# Altium schematic sheet PCB_Project_Wavelength.SchDoc
size A3; SheetNumber: 1; SheetTotal: 1
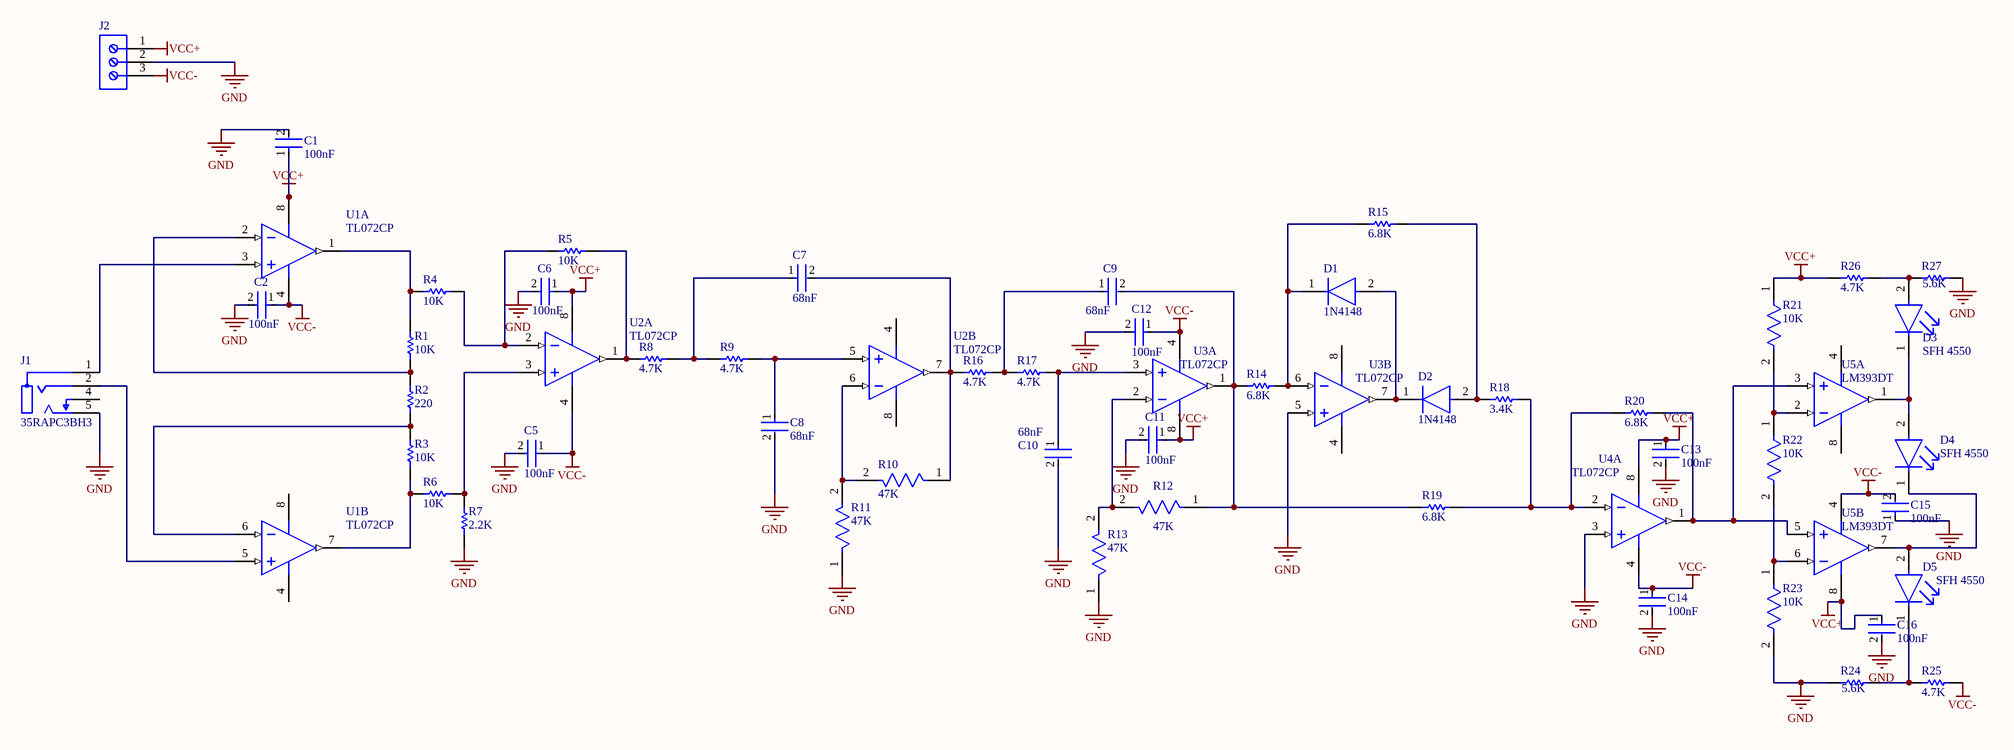
[diagram p0: PCB_Project_Wavelength.SchDoc]

## Parts
C1  100nF  [FP-CGA3E-0_3-0_1-IPC_A]
C2  100nF  [FP-CGA3E-0_3-0_1-IPC_A]
C5  100nF  [FP-CGA3E-0_3-0_1-IPC_A]
C6  100nF  [FP-CGA3E-0_3-0_1-IPC_A]
C7  68nF  [FP-1206-L_3_2_0_2-W_1_6_0-IPC_A]
C8  68nF  [FP-1206-L_3_2_0_2-W_1_6_0-IPC_A]
C9  68nF  [FP-1206-L_3_2_0_2-W_1_6_0-IPC_A]
C10  68nF  [FP-1206-L_3_2_0_2-W_1_6_0-IPC_A]
C11  100nF  [FP-CGA3E-0_3-0_1-IPC_A]
C12  100nF  [FP-CGA3E-0_3-0_1-IPC_A]
C13  100nF  [FP-CGA3E-0_3-0_1-IPC_A]
C14  100nF  [FP-CGA3E-0_3-0_1-IPC_A]
C15  100nF  [FP-CGA3E-0_3-0_1-IPC_A]
C16  100nF  [FP-CGA3E-0_3-0_1-IPC_A]
D1  1N4148  [FP-017AG-MFG]
D2  1N4148  [FP-017AG-MFG]
D3  SFH 4550  [FP-SFH_4550-MFG]
D4  SFH 4550  [FP-SFH_4550-MFG]
D5  SFH 4550  [FP-SFH_4550-MFG]
J1  35RAPC3BH3  [FP-35RAPC3BH3-MFG]
J2  691709710303  [691709710303]  (value not drawn)
R1  10K  [RESC1609X50X30NL8T20]
R2  220  [RESC2013X70X40NL20T20]
R3  10K  [RESC1609X50X30NL8T20]
R4  10K  [RESC1609X50X30NL8T20]
R5  10K  [RESC1609X50X30NL8T20]
R6  10K  [RESC1609X50X30NL8T20]
R7  2.2K  [RESC1608X55X25LL10T15]
R8  4.7K  [RESC1005X40X25LL05T05]
R9  4.7K  [RESC1005X40X25LL05T05]
R10  47K  [FP-CRCW0603-e3-IPC_B]
R11  47K  [FP-CRCW0603-e3-IPC_B]
R12  47K  [FP-CRCW0603-e3-IPC_B]
R13  47K  [FP-CRCW0603-e3-IPC_B]
R14  6.8K  [RESC1609X50X30LL10T20]
R15  6.8K  [RESC1609X50X30LL10T20]
R16  4.7K  [RESC1005X40X25LL05T05]
R17  4.7K  [RESC1005X40X25LL05T05]
R18  3.4K  [RESC1609X50X30LL10T20]
R19  6.8K  [RESC1609X50X30LL10T20]
R20  6.8K  [RESC1609X50X30LL10T20]
R21  10K  [FP-MCT0603-IPC_C]
R22  10K  [FP-MCT0603-IPC_C]
R23  10K  [FP-MCT0603-IPC_C]
R24  5.6K  [RESC1005X40X25LL05T05]
R25  4.7K  [RESC2013X70X40NL20T20]
R26  4.7K  [RESC2013X70X40NL20T20]
R27  5.6K  [RESC1005X40X25LL05T05]
U1  TL072CP  [P0008A]  (parts A,B of 2)
U2  TL072CP  [P0008A]  (parts A,B of 2)
U3  TL072CP  [P0008A]  (parts A,B of 2)
U4  TL072CP  [P0008A]  (part A of 2)
U5  LM393DT  [STM-SO-8_D_L]  (parts A,B of 2)

## Nets
GND: C1.2 C2.2 C5.2 C6.2 C8.2 C10.2 C11.2 C12.2 C13.2 C14.2 C15.1 C16.2 J1.5 J2.2 R7.1 R11.1 R13.1 R23.2 R24.1 R27.2 U3.5(IN2+) U4.3(IN1+)
VCC+: C1.1 C6.1 C11.1 C13.1 C16.1 J2.1 R21.1 R26.1 U1.8(VCC+) U2.8(VCC+) U3.8(VCC+) U4.8(VCC+) U5.8(VCC+)
VCC-: C2.1 C5.1 C12.1 C14.1 C15.2 J2.3 R25.2 U1.4(VCC-) U2.4(VCC-) U3.4(VCC-) U4.4(VCC-) U5.4(VCC-)
NetC7_1: C7.1 R8.2 R9.1
NetC7_2: C7.2 R10.1 R16.1 U2.7(OUT2)
NetC8_1: C8.1 R9.2 U2.5(IN2+)
NetC9_1: C9.1 R16.2 R17.1
NetC9_2: C9.2 R12.1 R14.1 R19.1 U3.1(OUT1)
NetC10_1: C10.1 R17.2 U3.3(IN1+)
NetD1_1: D1.1(C) R14.2 R15.1 U3.6(IN2-)
NetD1_2: D1.2(A) D2.1(C) U3.7(OUT2)
NetD2_2: D2.2(A) R15.2 R18.1
NetD3_1: D3.1(C) D4.2(A) U5.1(OUT1)
NetD3_2: D3.2(A) R26.2 R27.1
NetD4_1: D4.1(C) D5.2(A) U5.7(OUT2)
NetD5_1: D5.1(C) R24.2 R25.1
NetJ1_1: J1.1 U1.3(IN1+)
NetJ1_2: J1.2 U1.5(IN2+)
NetR1_1: R1.1 R2.2 U1.2(IN1-)
NetR1_2: R1.2 R4.2 U1.1(OUT1)
NetR2_1: R2.1 R3.2 U1.6(IN2-)
NetR3_1: R3.1 R6.2 U1.7(OUT2)
NetR4_1: R4.1 R5.2 U2.2(IN1-)
NetR5_1: R5.1 R8.1 U2.1(OUT1)
NetR6_1: R6.1 R7.2 U2.3(IN1+)
NetR10_2: R10.2 R11.2 U2.6(IN2-)
NetR12_2: R12.2 R13.2 U3.2(IN1-)
NetR18_2: R18.2 R19.2 R20.1 U4.2(IN1-)
NetR20_2: R20.2 U4.1(OUT1) U5.3(IN1+) U5.5(IN2+)
NetR21_2: R21.2 R22.1 U5.2(IN1-)
NetR22_2: R22.2 R23.1 U5.6(IN2-)

Not connected (* = marked no-connect by the designer): J1 4

## Library data of the parts
C1 C2 C5 C6 C11-C16 = CMP-2000-07546-2: Cap Ceramic 100nF 50V X7R 10% Pad SMD 0603 +125°C Automotive T/R; Weight: 7.1E-05oz; Composition: Ceramic; Max Operating Temperature: 125°C; Termination: SMD/SMT; Dielectric: X7R; Length: 1.6mm; Package Quantity: 1; REACH SVHC: No SVHC; Lead Free: Lead Free; Case Code (Metric): 1608; Min Operating Temperature: -55°C; Packaging: Tape and Reel; Tolerance: 10%; Voltage Rating: 50V; Case Code (Imperial): 0603; Capacitance: 100nF; Case/Package: 0603; Voltage Rating (DC): 50V; Depth: 0.8mm; Radiation Hardening: No; Ratings: AEC-Q200; Mount: Surface Mount; Voltage: 50V; Thickness: 0.035inch; Width: 0.8mm; Height: 0.8mm
C7-C10 = CMP-04427-019044-1: General Purpose Ceramic Capacitor, 1206, 68nF, 10%, X7R, 15%, 100V; Dissipation Factor: 2.5%; Construction: Flat; Packaging: Tape and Reel; Min Operating Temperature: -55°C; Package Quantity: 1; Voltage Rating (DC): 100V; Mount: Surface Mount; RoHS Compliant: Yes; Case/Package: 1206; Thickness: 0.037inch; Case Code (Imperial): 1206; Case Code (Metric): 3216; Max Operating Temperature: 125°C; Depth: 1.6mm; Length: 3.2mm; Series: -; REACH SVHC: No SVHC; Voltage: 100V; Number of Pins: 2; Width: 0.063inch; Voltage Rating: 100V; Capacitance: 68nF; Height: 0.94mm; Radiation Hardening: No; Lead Free: Lead Free; Termination: SMD/SMT; Tolerance: 10%; Dielectric: X7R
D1 D2 = CMP-07163-000046-1: DIODE GEN PURP 100V 200MA DO35; Forward Voltage: 1V; Max Power Dissipation: 500mW; Max Reverse Current: 5uA; Forward Current: 300mA; Current: 4A; Reverse Recovery Time: 4ns; Element Configuration: Single; Outside Diameter: 1.85mm; Capacitance: 4pF; Polarity: Standard; Max Forward Surge Current (Ifsm): 1A; Reverse Voltage: 100V; Output Current: 200mA; Average Rectified Current: 200mA; Diameter: 1.91mm; Max Repetitive Reverse Voltage (Vrrm): 100V; Current Rating: 200mA; Case/Package: DO-35; Lead Free: Lead Free; Number of Pins: 2; Recovery Time: 4ns; Packaging: Bulk; Contact Plating: Tin; Voltage: 100V; Mount: Through Hole; Max Surge Current: 4A; Package Quantity: 2000; Width: 1.91mm; Max Reverse Voltage (DC): 100V; Length: 4.56mm; Radiation Hardening: No; Power Dissipation: 500mW; Voltage Rating (DC): 100V; Peak Non-Repetitive Surge Current: 4A; REACH SVHC: No SVHC; Height: 4.56mm; Max Operating Temperature: 175°C; Series: -; Weight: 0.01lb; Min Operating Temperature: -65°C
D3-D5 = CMP-62016-000011-1: EMITTER IR 860NM 100MA RADIAL; Manufacturer: Osram Opto; Forward Voltage: 1.5V; Reverse Voltage: 5V; Viewing Angle: 6°; Led Orientation: Straight; Colour: Infrared; Mouser Description: Infrared Emitters - High Power Infrared 850 nm HALF ANGLE +/-3DEG; RoHS: TRUE; Manufacturer Part Number: SFH 4550; Forward Current: 100mA; Octopart: https://octopart.com/sfh+4550-osram+opto-55410894; ComponentLink2Description: Datasheet; Lead Free: Yes; Temperature: -40°C to +100°C; ComponentLink2URL: https://dammedia.osram.info/media/resource/hires/osram-dam-5580407/SFH%204550_EN.pdf; Device Class L2: LEDs; Temperature Range Low: -40°C; Digikey Description: EMITTER IR 860NM 100MA RADIAL; Temperature Range High: +100°C; Device Class L3: unset; Peak Emmision Wavelength: 860nm; Category: Diode; Package: SFH 4550; Device Class L1: Optoelectronics; Automotive: No
J1 = CMP-47983-000003-1: CONN JACK STEREO 3.5MM R/A; Gender: Female; Number of Positions: 3; Body Color: Black; Number of Ports: 1; Voltage Rating: 500V; Shielding: Unshielded; Body Material: Brass; Orientation: Right Angle; RoHS Compliant: Yes; Termination: Solder; Lead Free: Lead Free; Package Quantity: 1; Series: 35; Housing Material: PBT; Color: Black; Packaging: Bulk; Contact Plating: Silver; Mount: Through Hole; Contact Material: Copper Alloy; Number of Terminals/Pins: 3
J2 = CMP-1502-03336-2: Battery connector; NexarPartId: 34171770; Number of Contacts: 3; Voltage Rating: 300V; Connector Type: Screw; Current Rating: 6A; Wire/Cable Gauge: 30AWG; Plating: Steel; Number of Levels: 1; Wire Gauge (Min): 14AWG; Pitch: 5mm; Termination: Screw; Contact Plating: Tin; Max Operating Temperature: 130°C; Color: Black; RoHS: Compliant; Contact Material: Nickel; Number of Pins: 3; Packaging: Digi-Reel®; REACH SVHC: Unknown; Mount: Surface Mount; Lead Pitch: 5mm; Number of Positions Per Level: 3; Flammability Rating: UL94 V-0; Length: 15mm; Number of Positions: 3; Current: 6A; Min Operating Temperature: -40°C; Number of Rows: 1; Wire Gauge (Max): 30AWG; Housing Material: Nylon; Height: 10.2mm; Voltage: 300V
R1 R3-R6 = CMP-1666-00005-4: Chip Resistor, 10 KOhm, +/- 1%, 100 mW, -55 to 155 degC, 0603 (1608 Metric), RoHS, Tape and Reel; Manufacturer: Vishay Semiconductor; Voltage Rating: 75 V; Max Operating Temperature: 155 degC; PackageDescription: 2-Pin Surface Mount Device, Body 1.575 x 0.85 mm; ComponentLink1Description: Manufacturer URL; RoHSCompliant: true; PackageReference: 0603; REACH SVHC: Unknown; Length: 1.55 mm; DatasheetVersion: 06/2012; Packaging: Tape and Reel; Min Operating Temperature: -55 degC; Mounting Technology: Surface Mount; ComponentLink2URL: https://datasheet.ciiva.com/11809/0900766b80d98afc-11809037.pdf; Height: 0.45 mm; ComponentLink2Description: Datasheet; Package Quantity: 5000; ComponentLink1URL: http://www.vishay.com/
R2 = CMP-2001-00044-1: Part Number: ERJ6ENF2200V; Manufacturer: Panasonic
R7 = CMP-2000-06934-1: Thick Film Resistor, 2.2 KOhm, 100 mW, 50 V, +/- 1%, -55 to 155 degC, 2-Pin SMD (0603), RoHS, Tape and Reel; Manufacturer: Yageo; Resistance: 2.2kOhms; Temperature Coefficient: 100PPM/C; Voltage Rating: 50V; Power Rating: 100mW; Tolerance: 1%; Datasheet Version: Rev. 7, 05/2017; Case Code - mm: 1608; Series: RC; Mounting Technology: SurfaceMount; Package Description: 2-Pin Surface Mount Device, Body 1.6 x 0.8 mm; Case Code - in: 0603; Package Reference: 0603; Product: ThickFilmResistorsGeneralPurpose; Manufacturer URL: http://www.yageo.com/; Termination Style: SMD/SMT; Operating Temperature Range: -55Cto+155C; Datasheet URL: http://www.yageo.com/documents/recent/PYu-RC_Group_51_RoHS_L_7.pdf; Packaging: Reel
R8 R9 R16 R17 = CMP-2002-01154-4: Chip Resistor, 4.7 KOhm, +/- 1%, 0.1 W, -55 to 155 degC, 0402 (1005 Metric), RoHS, Tape and Reel; PartNumber: ERJ-2RKF4701X; Voltage Rating: 50 V; Case\/Package: 0402; Power Rating: 100 mW; Height: 0.35 mm; Mounting Technology: Surface Mount; REACH SVHC: Yes; Resistance: 4.7 KOhm; Max Operating Temperature: 155 degC; ComponentLink1Description: Manufacturer URL; ComponentLink2Description: Datasheet; Pins: 2; PackageReference: 0402; Tolerance: 1%; Case Code (Imperial): 0402; Length: 1 mm; PackageDescription: 2-Pin Surface Mount Device, Body 1 x 0.5 mm; RoHSCompliant: true; Package Quantity: 1; Radiation Hardening: No; DatasheetVersion: 04/2015; Width: 0.5 mm; Case Code (Metric): 1005; Mount: Surface Mount; ComponentLink1URL: http://www.panasonic.com/; Min Operating Temperature: -55 degC; Packaging: Cut Tape; ComponentLink2URL: http://industrial.panasonic.com/cdbs/www-data/pdf/RDA0000/AOA0000C86.pdf
R10-R13 = CMP-2000-03379-3: RES SMD 47K OHM 1% 1/10W 0603; Voltage Rating: 75V; Max Power Dissipation: 100mW; Resistance: 47kR; Temperature Coefficient: 100ppm/°C; Size Code: 0603; Technology: THICK FILM; Case Code (Metric): 1608; Radiation Hardening: No; Case/Package: 0603; Number of Terminations: 2; Package Quantity: 5000; Width: 0.85mm; Series: CRCW; RoHS Compliant: Yes; Case Code (Imperial): 0603; Lead Free: Lead Free; Resistance Tolerance: 1%; Depth: 0.85mm; Contact Plating: Tin; Tolerance: 1%; Voltage Rating (DC): 75V; Min Operating Temperature: -55°C; Mount: Surface Mount; Packaging: Tape and Reel; Length: 1.55mm; Resistor Type: Thick Film; Features: Automotive AEC-Q200; Max Operating Temperature: 155°C; Weight: 7.1E-05oz; Construction: Rectangular; Height: 0.45mm; Military Standard: Not; Termination: SMD/SMT; Power Rating: 100mW
R14 R15 R19 R20 = CMP-2000-03550-1: Part Number: CRCW06036K80FKEA; Manufacturer: Vishay Dale
R18 = CMP-2000-03303-1: Manufacturer: Vishay Dale; Part Number: CRCW06033K40FKEA
R21-R23 = CMP-02407-000418-1: RES SMD 100 OHM 1% 1/8W 0603; Voltage Rating: 75V; Power Rating: 100mW; Temperature Coefficient: 50ppm/°C; Max Power Dissipation: 125mW; Resistance: 10kR; Case/Package: 0603; Military Standard: Not; Min Operating Temperature: -55°C; Width: 0.8mm; Package Quantity: 1; Max Operating Temperature: 125°C; Tolerance: 1%; Depth: 0.85mm; Radiation Hardening: No; Mount: Surface Mount; Composition: Thin Film; Contact Plating: Tin; Lead Free: Lead Free; Case Code (Imperial): 0603; Number of Terminations: 2; Voltage Rating (DC): 75V; Length: 1.55mm; Packaging: Tape and Reel; Height: 0.022inch; Case Code (Metric): 1608
R24 R27 = CMP-2002-00121-1: Manufacturer: Vishay Dale; Part Number: CRCW04025K60FKED
R25 R26 = CMP-2001-00550-5: Chip Resistor, 4.7 KOhm, +/- 1%, 0.125 W, -55 to 155 degC, 0805 (2012 Metric), RoHS, Tape and Reel; Manufacturer: Panasonic; Voltage Rating: 150 V; Min Operating Temperature: -55 degC; PackageReference: 0805; Mounting Technology: Surface Mount; Height: 0.6 mm; PackageDescription: 2-Pin Surface Mount Device, Body 2 x 1.25 mm; RoHSCompliant: true; Length: 2 mm; REACH SVHC: Yes; Packaging: Tape and Reel; Pins: 2; Mount: Surface Mount; ComponentLink2Description: Datasheet; ComponentLink1URL: http://www.panasonic.com/; ComponentLink1Description: Manufacturer URL; DatasheetVersion: 04/2015; Package Quantity: 5000; ComponentLink2URL: http://industrial.panasonic.com/cdbs/www-data/pdf/RDA0000/AOA0000C86.pdf; Max Operating Temperature: 155 degC
U1-U4 = CMP-0017-00950-2: Dual Low-Noise JFET-Input General-Purpose Operational Amplifier, 7 to 36 V, 0 to 70 degC, 8-pin DIP (P8), Pb-Free (RoHS); Manufacturer: Texas Instruments; Sub Family: General Purpose Amplifier, High Supply Voltage Amplifier (>=30V); Total Supply Voltage(Max)(+5V is 5, +/-5V is 10): 36; Slew Rate(Typ)(V/us): 13; Vn at 1kHz(Typ)(nV/rtHz): 18; GBW(Typ)(MHz): 3; CMRR(Min)(dB): 70; Total Supply Voltage(Min)(+5V is 5, +/-5V is 10): 7; Vio (25C)(Max)(mV): 10; Rating: Catalog; IIB(Max)(pA): 200; Iq per channel(Max)(mA): 2.5; Number of Channels: 2; Mounting Technology: Through Hole; ComponentLink3Description: Package Specification; PartNumber: TL072CP; PackageVersion: 4040082/E, 04/2010; Eco-Plan: Pb-Free (RoHS); DatasheetVersion: SLOS080J; Offset Drift(Typ)(uV/C): 18; ComponentLink3URL: http://www.ti.com/litv/pdf/mpdi001b; PackageDescription: 8-Pin Plastic In-Line, Body 9.59 x 6.35 mm, Pitch 2.54 mm; Code_JEDEC: MS-001; ComponentLink2URL: http://www.ti.com/lit/ds/symlink/tl072.pdf; ComponentLink1Description: Manufacturer URL; ComponentLink2Description: Datasheet; ComponentLink1URL: http://www.ti.com/; PackageReference: P0008A
U5 = CMP-2000-06550-1: Low-Power, Dual-Voltage Comparator, 2 to 36 V, 0 to 70 degC, 8-Pin SOIC (SO), RoHS, Tape and Reel; Manufacturer: STMicroelectronics; Voltage - Supply, Single/Dual (±): 2V~36V,±1V~18V; Current - Input Bias (Max): 0.25µA@5V; Number of Elements: 2; Current - Output (Typ): 18mA@5V; Other Names: 497-1593-2; Voltage - Input Offset (Max): 5mV@30V; Output Type: CMOS,DTL,ECL,MOS,Open-Collector,TTL; EDA / CAD Models: DownloadfromAcceleratedDesigns; Other Related Documents: LM393ViewAllSpecificationsLM393ViewAllSpecifications; Online Catalog: Comparators-2elements; Current - Quiescent (Max): 2.5mA; Standard Package: 2,500; Manufacturer URL: http://www.st.com/; Package Description: 8-Pin Small Outline Integrated Circuit, Body 4.9 x 3.9 mm, Pitch 1.27 mm; Packaging: Tape&Reel(TR); Datasheet Version: Rev. 15, 02/2016; Category: IntegratedCircuits(ICs); Operating Temperature: 0°C~70°C; Mounting Type: SurfaceMount; Supplier Device Package: 8-SO; Datasheet URL: http://www.st.com/content/ccc/resource/technical/document/datasheet/group1/b4/cc/cf/13/18/28/44/f5/CD00000465/files/CD00000465.pdf/jcr:content/translations/en.CD00000465.pdf; Family: Linear-Comparators; Mounting Technology: SurfaceMount; Type: GeneralPurpose; Package Reference: SO-8; Package / Case: 8-SOIC(0.154",3.90mmWidth)